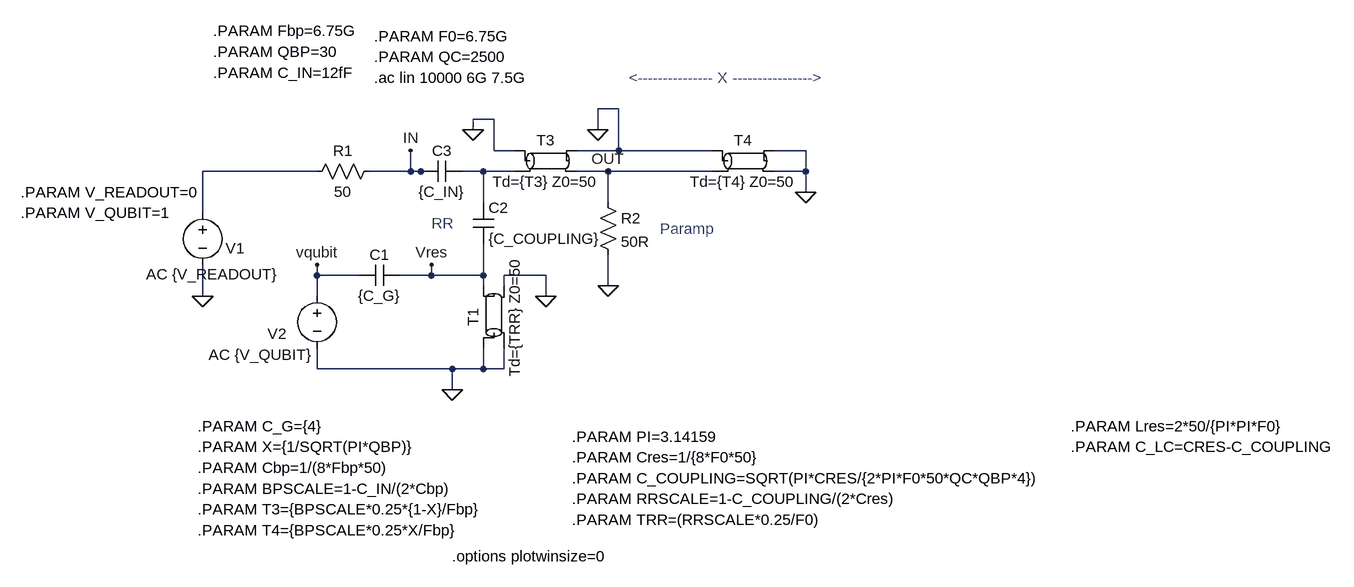
[diagram p0: schematic bpfilter_pi4_qubitT1.asc]
bpfilter_pi4_qubitT1.asc, the LTspice schematic file:
Version 4
SHEET 1 1544 784
WIRE 384 64 352 64
WIRE 192 80 160 80
WIRE 160 96 160 80
WIRE 352 96 352 64
WIRE 192 128 192 80
WIRE 224 128 192 128
WIRE 384 128 384 64
WIRE 384 128 320 128
WIRE 528 128 384 128
WIRE 672 128 624 128
WIRE -80 160 -256 160
WIRE 64 160 64 128
WIRE 64 160 0 160
WIRE 80 160 64 160
WIRE 96 160 80 160
WIRE 176 160 144 160
WIRE 224 160 176 160
WIRE 368 160 320 160
WIRE 528 160 368 160
WIRE 672 160 672 128
WIRE 672 160 624 160
WIRE 672 192 672 160
WIRE 176 208 176 160
WIRE 368 208 368 160
WIRE -256 224 -256 160
WIRE -80 320 -80 304
WIRE -16 320 -80 320
WIRE 96 320 96 304
WIRE 96 320 48 320
WIRE 176 320 176 272
WIRE 176 320 96 320
WIRE 272 320 208 320
WIRE 176 336 176 320
WIRE 208 336 208 320
WIRE 368 336 368 288
WIRE -256 352 -256 304
WIRE -80 352 -80 320
WIRE 272 352 272 320
WIRE -80 464 -80 432
WIRE 128 464 -80 464
WIRE 176 464 176 432
WIRE 176 464 128 464
WIRE 208 464 208 432
WIRE 208 464 176 464
WIRE 128 496 128 464
FLAG 672 192 0
FLAG 368 336 0
FLAG 160 96 0
FLAG 352 96 0
FLAG 368 160 OUT
FLAG 96 304 Vres
FLAG -256 352 0
FLAG 64 128 IN
FLAG 128 496 0
FLAG 272 352 0
FLAG -80 304 vqubit
SYMBOL tline 272 144 R0
SYMATTR InstName T3
SYMATTR Value Td={T3} Z0=50
SYMBOL tline 576 144 R0
SYMATTR InstName T4
SYMATTR Value Td={T4} Z0=50
SYMBOL res 352 192 R0
SYMATTR InstName R2
SYMATTR Value 50R
SYMBOL cap 160 208 R0
SYMATTR InstName C2
SYMATTR Value {C_COUPLING}
SYMBOL cap 144 144 R90
WINDOW 0 0 32 VBottom 2
WINDOW 3 32 32 VTop 2
SYMATTR InstName C3
SYMATTR Value {C_IN}
SYMBOL voltage -256 208 R0
WINDOW 3 24 44 Left 2
WINDOW 123 -87 110 Left 2
WINDOW 39 24 152 Left 2
WINDOW 0 35 70 Left 2
SYMATTR Value ""
SYMATTR Value2 AC {V_READOUT}
SYMATTR InstName V1
SYMBOL res 16 144 R90
WINDOW 0 0 56 VBottom 2
WINDOW 3 32 56 VTop 2
SYMATTR InstName R1
SYMATTR Value 50
SYMBOL tline 192 384 R270
SYMATTR InstName T1
SYMATTR Value Td={TRR} Z0=50
SYMBOL voltage -80 336 R0
WINDOW 3 24 44 Left 2
WINDOW 123 -167 106 Left 2
WINDOW 39 24 152 Left 2
WINDOW 0 -76 74 Left 2
SYMATTR Value ""
SYMATTR Value2 AC {V_QUBIT}
SYMATTR InstName V2
SYMBOL cap 48 304 R90
WINDOW 0 0 32 VBottom 2
WINDOW 3 32 32 VTop 2
SYMATTR InstName C1
SYMATTR Value {C_G}
TEXT 448 248 Left 2 ;Paramp
TEXT 400 16 Left 2 ;<--------------- X ---------------->
TEXT -264 584 Left 2 !.PARAM X={1/SQRT(PI*QBP)}
TEXT 8 -48 Left 2 !.PARAM F0=6.75G
TEXT -264 712 Left 2 !.PARAM T4={BPSCALE*0.25*X/Fbp}
TEXT -264 680 Left 2 !.PARAM T3={BPSCALE*0.25*{1-X}/Fbp}
TEXT 312 600 Left 2 !.PARAM Cres=1/{8*F0*50}
TEXT 1080 552 Left 2 !.PARAM Lres=2*50/{PI*PI*F0}
TEXT 312 568 Left 2 !.PARAM PI=3.14159
TEXT 8 16 Left 2 !.ac lin 10000 6G 7.5G
TEXT 8 -16 Left 2 !.PARAM QC=2500
TEXT 312 632 Left 2 !.PARAM C_COUPLING=SQRT(PI*CRES/{2*PI*F0*50*QC*QBP*4})
TEXT 1080 584 Left 2 !.PARAM C_LC=CRES-C_COUPLING
TEXT 96 240 Left 2 ;RR
TEXT -240 -24 Left 2 !.PARAM QBP=30
TEXT -264 648 Left 2 !.PARAM BPSCALE=1-C_IN/(2*Cbp)
TEXT 128 752 Left 2 !.options plotwinsize=0
TEXT -240 8 Left 2 !.PARAM C_IN=12fF
TEXT -264 616 Left 2 !.PARAM Cbp=1/(8*Fbp*50)
TEXT -240 -56 Left 2 !.PARAM Fbp=6.75G
TEXT 312 664 Left 2 !.PARAM RRSCALE=1-C_COUPLING/(2*Cres)
TEXT 312 696 Left 2 !.PARAM TRR=(RRSCALE*0.25/F0)
TEXT -536 192 Left 2 !.PARAM V_READOUT=0
TEXT -536 224 Left 2 !.PARAM V_QUBIT=1
TEXT -264 552 Left 2 !.PARAM C_G={4}

The netlist it stands for:
* bpfilter_pi4_qubitT1.asc
T3 0 N002 0 OUT Td={T3} Z0=50
T4 0 OUT 0 0 Td={T4} Z0=50
R2 OUT 0 50R
C2 N002 Vres {C_COUPLING}
C3 N002 IN {C_IN}
V1 N001 0 AC {V_READOUT}
R1 IN N001 50
T1 0 0 Vres 0 Td={TRR} Z0=50
V2 vqubit 0 AC {V_QUBIT}
C1 Vres vqubit {C_G}
* Paramp
* <--------------- X ---------------->
.PARAM X={1/SQRT(PI*QBP)}
.PARAM F0=6.75G
.PARAM T4={BPSCALE*0.25*X/Fbp}
.PARAM T3={BPSCALE*0.25*{1-X}/Fbp}
.PARAM Cres=1/{8*F0*50}
.PARAM Lres=2*50/{PI*PI*F0}
.PARAM PI=3.14159
.ac lin 10000 6G 7.5G
.PARAM QC=2500
.PARAM C_COUPLING=SQRT(PI*CRES/{2*PI*F0*50*QC*QBP*4})
.PARAM C_LC=CRES-C_COUPLING
* RR
.PARAM QBP=30
.PARAM BPSCALE=1-C_IN/(2*Cbp)
.options plotwinsize=0
.PARAM C_IN=12fF
.PARAM Cbp=1/(8*Fbp*50)
.PARAM Fbp=6.75G
.PARAM RRSCALE=1-C_COUPLING/(2*Cres)
.PARAM TRR=(RRSCALE*0.25/F0)
.PARAM V_READOUT=0
.PARAM V_QUBIT=1
.PARAM C_G={4}
.backanno
.end